# EAGLE design Open_tES (EAGLE 6.5.0)
AUTHOR: PATRICE ANDRIEU; VERSION: 1.00
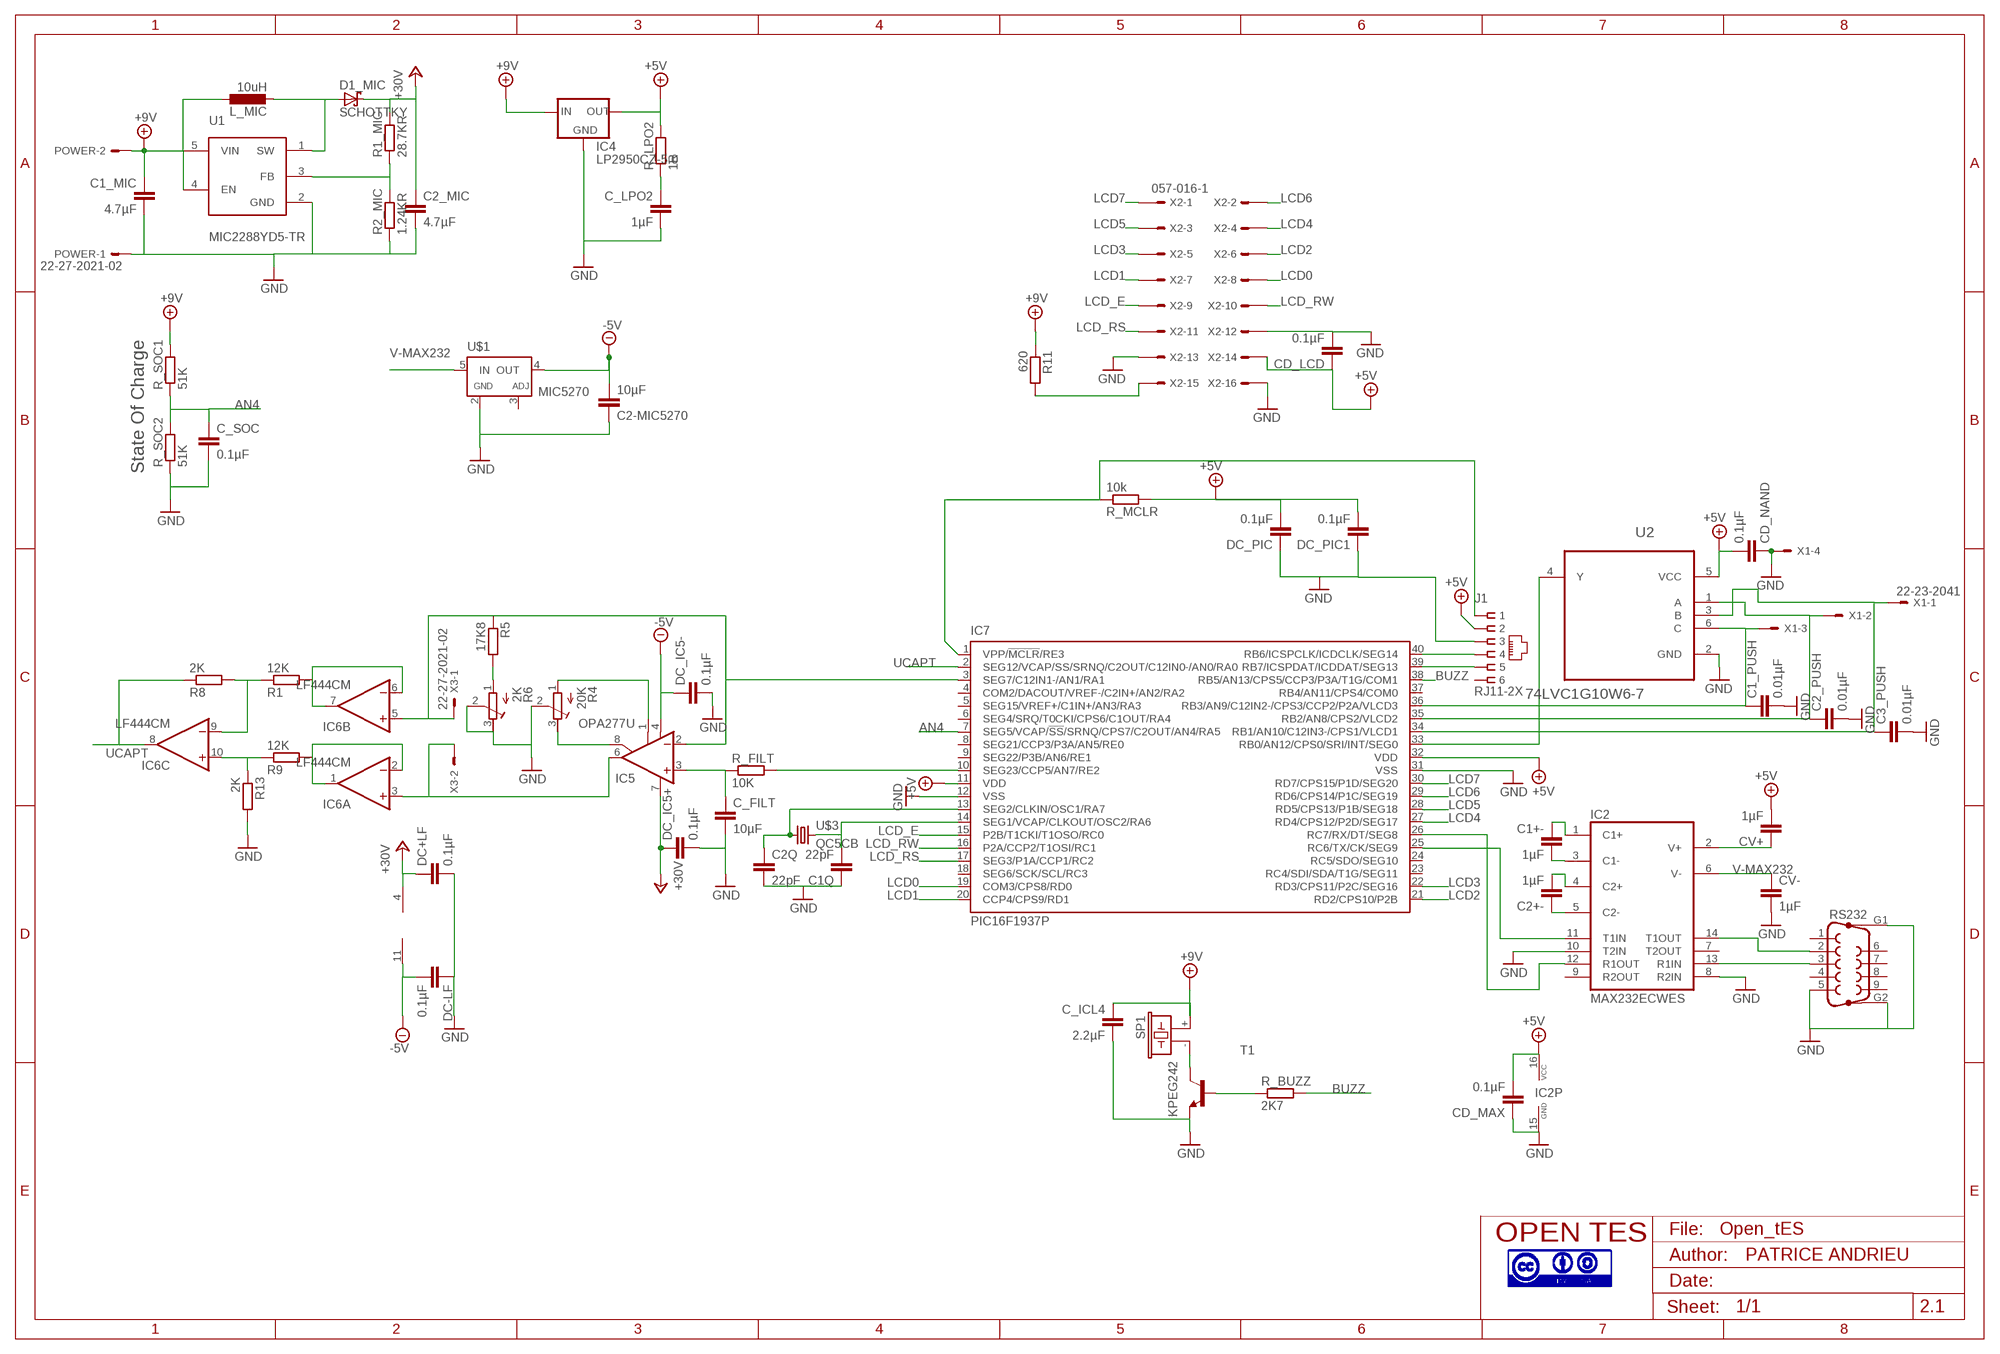
[diagram p0: schematic, sheet 1]

## Parts
C1+-  1µF  C-EUC0805  [C0805]
C1_MIC  4.7µF  C-EUC0805  [C0805]
C1_PUSH  0.01µF  C-EUC0805  [C0805]
C1Q  22pF  C-EUC0805  [C0805]
C2+-  1µF  C-EUC0805  [C0805]
C2-MIC5270  10µF  C-EUC0805  [C0805]
C2_MIC  4.7µF  C-EUC0805  [C0805]
C2_PUSH  0.01µF  C-EUC0805  [C0805]
C2Q  22pF  C-EUC0805  [C0805]
C3_PUSH  0.01µF  C-EUC0805  [C0805]
C_FILT  10µF  C-EUC0805  [C0805]
C_ICL4  2.2µF  C-EUC0805K  [C0805K]
C_LPO2  1µF  C-EUC0805  [C0805]
C_SOC  0.1µF  C-EUC0805  [C0805]
CD_LCD  0.1µF  C-EUC0805  [C0805]
CD_MAX  0.1µF  C-EUC0805  [C0805]
CD_NAND  0.1µF  C-EUC0805  [C0805]
CV+  1µF  C-EUC0805  [C0805]
CV-  1µF  C-EUC0805  [C0805]
D1_MIC  SCHOTTKY  [SOD80]
DC+LF  0.1µF  C-EUC0805  [C0805]
DC-LF  0.1µF  C-EUC0805  [C0805]
DC_IC5+  0.1µF  C-EUC0805  [C0805]
DC_IC5-  0.1µF  C-EUC0805  [C0805]
DC_PIC  0.1µF  C-EUC0805  [C0805]
DC_PIC1  0.1µF  C-EUC0805  [C0805]
IC2  MAX232ECWES  [SO16]
IC4  LP2950CZ-5.0  [TO92]
IC5  OPA277U  [SO08]
IC6  LF444CM  [SO14]
IC7  PIC16F1937P  [DIL40]
J1  RJ11-2X  [RJ11-NO_SHIELD]
L_MIC  10uH  L-EUL2012C  [L2012C]
POWER  22-27-2021-02  [6410-02]
R1  12K  R-EU_R0805  [R0805]
R1_MIC  28.7KR  R-EU_R0805  [R0805]
R2_MIC  1.24KR  R-EU_R0805  [R0805]
R4  20K  R-TRIMM3214W  [RTRIM3214W]
R5  17K8  R-EU_M0805  [M0805]
R6  2K  R-TRIMM3214W  [RTRIM3214W]
R8  2K  R-EU_R0805  [R0805]
R9  12K  R-EU_R0805  [R0805]
R11  620  R-EU_0204/7  [0204/7]
R13  2K  R-EU_R0805  [R0805]
R_BUZZ  2K7  R-EU_R0805  [R0805]
R_FILT  10K  R-EU_R0805  [R0805]
R_LPO2  1R  R-EU_R0805  [R0805]
R_MCLR  10k  R-EU_0204/7  [0204/7]
R_SOC1  51K  R-EU_R0805  [R0805]
R_SOC2  51K  R-EU_R0805  [R0805]
RS232  F09HP  [F09HP]
SP1  KPEG242  [KPEG242]
T1  BFR92-NPN-SOT23-BEC  [SOT23-BEC]
U1  MIC2288YD5-TR  [SOT23-5L]
U2  74LVC1G10W6-7  [SOT95P280X135-6N]
U$1  MIC5270  [SOT23-5L]
U$3  QC5CB  [QC5CB]
U$4  FRAME  [OPEN_TE_VERSION]
X1  22-23-2041  [22-23-2041]
X2  057-016-1  [057-016-1]
X3  22-27-2021-02  [6410-02]

## Nets
+5V/1: CD_LCD.1 CD_MAX.2 CD_NAND.2 CV+.2 DC_PIC1.2 DC_PIC.2 IC2.16(VCC) IC4.1(OUT) IC7.11(VDD) IC7.32(VDD) J1.2 R_LPO2.2 R_MCLR.2 U2.5(VCC) X2.14 ; supply symbol labelled +5V
+9V: C1_MIC.1 C_ICL4.1 IC4.3(IN) L_MIC.1 POWER.2 R11.1 R_SOC1.2 SP1.+ U1.4(EN) U1.5(VIN)
+30V: C2_MIC.1 D1_MIC.C DC+LF.1 DC_IC5+.1 IC5.7(V+) IC6.4(P:V+) R1_MIC.2
-5V: C2-MIC5270.2 DC-LF.2 DC_IC5-.1 IC5.4(V-) IC6.11(P:V-) U$1.4(OUT)
AN4: C_SOC.1 IC7.7(SEG5/VCAP/!SS!/SRNQ/CPS7/C2OUT/AN4/RA5) R_SOC1.1 R_SOC2.2
BUZZ: IC7.38(RB5/AN13/CPS5/CCP3/P3A/T1G/COM1) R_BUZZ.2
GND: C1_MIC.2 C1_PUSH.2 C1Q.1 C2-MIC5270.1 C2_MIC.2 C2_PUSH.2 C2Q.2 C3_PUSH.2 C_FILT.2 C_ICL4.2 C_LPO2.2 C_SOC.2 CD_LCD.2 CD_MAX.1 CD_NAND.1 CV-.2 DC+LF.2 DC-LF.1 DC_IC5+.2 DC_IC5-.2 DC_PIC1.1 DC_PIC.1 IC2.8(R2IN) IC2.10(T2IN) IC2.15(GND) IC4.2(GND) IC7.12(VSS) IC7.31(VSS) J1.3 POWER.1 R2_MIC.1 R4.2(S) R6.2(S) R6.3(E) R13.2 R_SOC2.1 RS232.5 RS232.G1 RS232.G2 T1.E U1.2(GND) U2.2(GND) U$1.2(GND) X1.4 X2.12 X2.13 X2.16
ICAPT: IC5.2(-IN) IC6.5(B:+IN) IC7.3(SEG7/C12IN1-/AN1/RA1) R5.1 X3.1
LCD0: IC7.19(COM3/CPS8/RD0) X2.8
LCD1: IC7.20(CCP4/CPS9/RD1) X2.7
LCD2: IC7.21(RD2/CPS10/P2B) X2.6
LCD3: IC7.22(RD3/CPS11/P2C/SEG16) X2.5
LCD4: IC7.27(RD4/CPS12/P2D/SEG17) X2.4
LCD5: IC7.28(RD5/CPS13/P1B/SEG18) X2.3
LCD6: IC7.29(RD6/CPS14/P1C/SEG19) X2.2
LCD7: IC7.30(RD7/CPS15/P1D/SEG20) X2.1
LCD_E: IC7.15(P2B/T1CKI/T1OSO/RC0) X2.9
LCD_RS: IC7.17(SEG3/P1A/CCP1/RC2) X2.11
LCD_RW: IC7.16(P2A/CCP2/T1OSI/RC1) X2.10
MCLR: IC7.1(VPP/!MCLR!/RE3) J1.1 R_MCLR.1
N$1: SP1.- T1.C
N$2: IC6.6(B:-IN) IC6.7(B:OUT) R1.2
N$3: C1+-.1 IC2.1(C1+)
N$4: R5.2 R6.1(A)
N$5: C2+-.2 IC2.4(C2+)
N$6: C1Q.2 IC7.14(SEG1/VCAP/CLKOUT/OSC2/RA6) U$3.2
N$7: IC2.14(T1OUT) RS232.2
N$8: IC2.13(R1IN) RS232.3
N$9: C3_PUSH.1 IC7.34(RB1/AN10/C12IN3-/CPS1/VLCD1) U2.3(B) X1.1
N$10: R1_MIC.1 R2_MIC.2 U1.3(FB)
N$11: IC2.11(T1IN) IC7.25(RC6/TX/CK/SEG9)
N$12: R_BUZZ.1 T1.B
N$13: IC6.10(C:+IN) R9.1 R13.1
N$14: IC6.9(C:-IN) R1.1 R8.2
N$15: IC2.12(R1OUT) IC7.26(RC7/RX/DT/SEG8)
N$16: IC5.8(CMP2) R4.3(E)
N$17: IC6.1(A:OUT) IC6.2(A:-IN) R9.2
N$18: C1_PUSH.1 IC7.36(RB3/AN9/C12IN2-/CPS3/CCP2/P2A/VLCD3) U2.6(C) X1.3
N$19: C_FILT.1 IC5.3(+IN) R_FILT.1
N$20: C2Q.1 IC7.13(SEG2/CLKIN/OSC1/RA7) U$3.1
N$21: C_LPO2.1 R_LPO2.1
N$22: C1+-.2 IC2.3(C1-)
N$23: C2_PUSH.1 IC7.35(RB2/AN8/CPS2/VLCD2) U2.1(A) X1.2
N$25: IC7.33(RB0/AN12/CPS0/SRI/INT/SEG0) U2.4(Y)
N$28: IC5.1(CMP1) R4.1(A)
N$29: IC5.6(OUT) IC6.3(A:+IN) X3.2
N$30: C2+-.1 IC2.5(C2-)
N$31: CV+.1 IC2.2(V+)
N$32: R11.2 X2.15
N$35: D1_MIC.A L_MIC.2 U1.1(SW)
PGC: IC7.39(RB7/ICSPDAT/ICDDAT/SEG13) J1.5
PGD: IC7.40(RB6/ICSPCLK/ICDCLK/SEG14) J1.4
PWM: IC7.10(SEG23/CCP5/AN7/RE2) R_FILT.2
UCAPT: IC6.8(C:OUT) IC7.2(SEG12/VCAP/SS/SRNQ/C2OUT/C12IN0-/AN0/RA0) R8.1
V-MAX232: CV-.1 IC2.6(V-) U$1.5(IN)
Unconnected: IC2.7(T2OUT) IC2.9(R2OUT) IC6.12(D:+IN) IC6.13(D:-IN) IC6.14(D:OUT) IC7.4(COM2/DACOUT/VREF-/C2IN+/AN2/RA2) IC7.5(SEG15/VREF+/C1IN+/AN3/RA3) IC7.6(SEG4/SRQ/T0CKI/CPS6/C1OUT/RA4) IC7.8(SEG21/CCP3/P3A/AN5/RE0) IC7.9(SEG22/P3B/AN6/RE1) IC7.18(SEG6/SCK/SCL/RC3) IC7.23(RC4/SDI/SDA/T1G/SEG11) IC7.24(RC5/SDO/SEG10) IC7.37(RB4/AN11/CPS4/COM0) J1.6 RS232.1 RS232.4 RS232.6 RS232.7 RS232.8 RS232.9 U$1.3(ADJ)

## Notes on the sheet
- State Of Charge

## Library data of the parts
C1+- C2+- C_LPO2 CV+ CV- = rcl:C-EU: CAPACITOR, European symbol; OC_FARNELL: 2496946
C1_MIC = rcl:C-EU: CAPACITOR, European symbol; OC_FARNELL: 2458302
C1_PUSH C2_PUSH C3_PUSH = rcl:C-EU: CAPACITOR, European symbol; OC_FARNELL: 1414662
C1Q C2Q = rcl:C-EU: CAPACITOR, European symbol; OC_FARNELL: 1856180
C2-MIC5270 C_FILT = rcl:C-EU: CAPACITOR, European symbol; OC_FARNELL: 2346934
C2_MIC = rcl:C-EU: CAPACITOR, European symbol; OC_FARNELL: 2426962
C_ICL4 = rcl:C-EU: CAPACITOR, European symbol; OC_FARNELL: 9227822
C_SOC CD_LCD CD_MAX CD_NAND DC-LF DC_IC5+ DC_IC5- DC_PIC DC_PIC1 = rcl:C-EU: CAPACITOR, European symbol; OC_FARNELL: 1414664
D1_MIC = Open_tES:SCHOTTKY: Schottky diode; OC_FARNELL: 1469389
DC+LF = rcl:C-EU: CAPACITOR, European symbol; OC_FARNELL: 1653290
IC2 = maxim-6b:MAX232ECWE: RS232 TRANSEIVER; OC_FARNELL: 2511968
IC4 = v-reg:LP2950?*: Source: http://cache.national.com/ds/LP/LP2950.pdf; OC_FARNELL: 9489479
IC5 = linear:OPA277: High Precision OPERATIONAL AMPLIFIERS REPLACES OP-07, OP-77, OP-177 Source: opa277.pdf; OC_FARNELL: 1097478
IC6 = Open_tES:LF444CM; OC_FARNELL: 1564711
IC7 = microchip:PIC16F193*?: Flash-Based, 8-Bit CMOS Microcontrollers wtih LCD Driver and nanoWatt XLP Technology Auto generated by make-symbol-device-package-bsdl.ulp Rev. 33 Source: http://ww1.microchip.com/downloads/en/DeviceDoc/41364D.pdf; MPN: PIC16F1937-I/P; OC_FARNELL: 1755825; OC_NEWARK: 45P4774
J1 = con-tycoelectronics:RJ11: CORCOM Modular RJ Jacks No Shield Source: www.tycoelectronics.com .. ENG_DS_1654001_1099_RJ_L_0507.pdf; OC_FARNELL: 3363132; OC_NEWARK: unknown
L_MIC = rcl:L-EU: INDUCTOR, European symbol; OC_FARNELL: 1463501
POWER X3 = con-molex:22-?-02: CONNECTOR wire to board 2.54 mm (.1 inch) pitch header; OC_FARNELL: 9731148+1654528+1462641; OC_NEWARK: unknown
R1 R9 = rcl:R-EU_: RESISTOR, European symbol; OC_FARNELL: 1653290
R1_MIC = rcl:R-EU_: RESISTOR, European symbol; OC_FARNELL: 1167459
R2_MIC = rcl:R-EU_: RESISTOR, European symbol; OC_FARNELL: 2303560
R4 = rcl:R-TRIMM: Trimm resistor; OC_FARNELL: 988285
R5 = rcl:R-EU_: RESISTOR, European symbol; OC_FARNELL: 1575931
R6 = rcl:R-TRIMM: Trimm resistor; OC_FARNELL: 988250
R8 R13 = rcl:R-EU_: RESISTOR, European symbol; OC_FARNELL: 1653296
R11 = rcl:R-EU_: RESISTOR, European symbol; OC_FARNELL: 2329960
R_BUZZ = rcl:R-EU_: RESISTOR, European symbol; OC_FARNELL: 9339361
R_FILT = rcl:R-EU_: RESISTOR, European symbol; OC_FARNELL: 9332383
R_LPO2 = rcl:R-EU_: RESISTOR, European symbol; OC_FARNELL: 2057662
R_MCLR = rcl:R-EU_: RESISTOR, European symbol; OC_FARNELL: 9339060
R_SOC1 R_SOC2 = rcl:R-EU_: RESISTOR, European symbol; OC_FARNELL: 2447680
RS232 = con-subd:F09HP: SUB-D; OC_FARNELL: 1084701; OC_NEWARK: unknown
SP1 = Open_tES:KPEG242; OC_FARNELL: 1502726
T1 = transistor-neu-to92:*-NPN-: NPN Transistror; OC_FARNELL: 1056520; OV_FARNELL: 1056520RL
U1 = Open_tES:MIC2288YD5-TR: Regulator DC/DC boost in 2.5-10V out 3.6-34V; OC_FARNELL: 2509929
U2 = Open_tES:74LVC1G10W6-7: SINGLE 3 INPUT POSITIVE NAND GATE; MPN: 74LVC1G10W6-7; OC_FARNELL: 1893823; OC_NEWARK: 47T3912; PACKAGE: SOT-6; SUPPLIER: DIODES INC.
U$1 = Open_tES:MIC5270: Negative Low-dropout Regulator; OC_FARNELL: 2510309
U$3 = Open_tES:QC5CB; OC_FARNELL: 2508614
U$4 = Open_tES:FRAME; VERSION: 2.1
X1 = con-molex:22-23-2041: .100" (2.54mm) Center Header - 4 Pin; MF: MOLEX; MPN: 22-23-2041; OC_FARNELL: 1462920+1462809+1462641; OC_NEWARK: 38C0355
X2 = con-panduit:057-016-: CONNECTOR 10-pin series 057 contact pc board low profile headers; OC_FARNELL: 1554029; OC_NEWARK: unknown

## Board
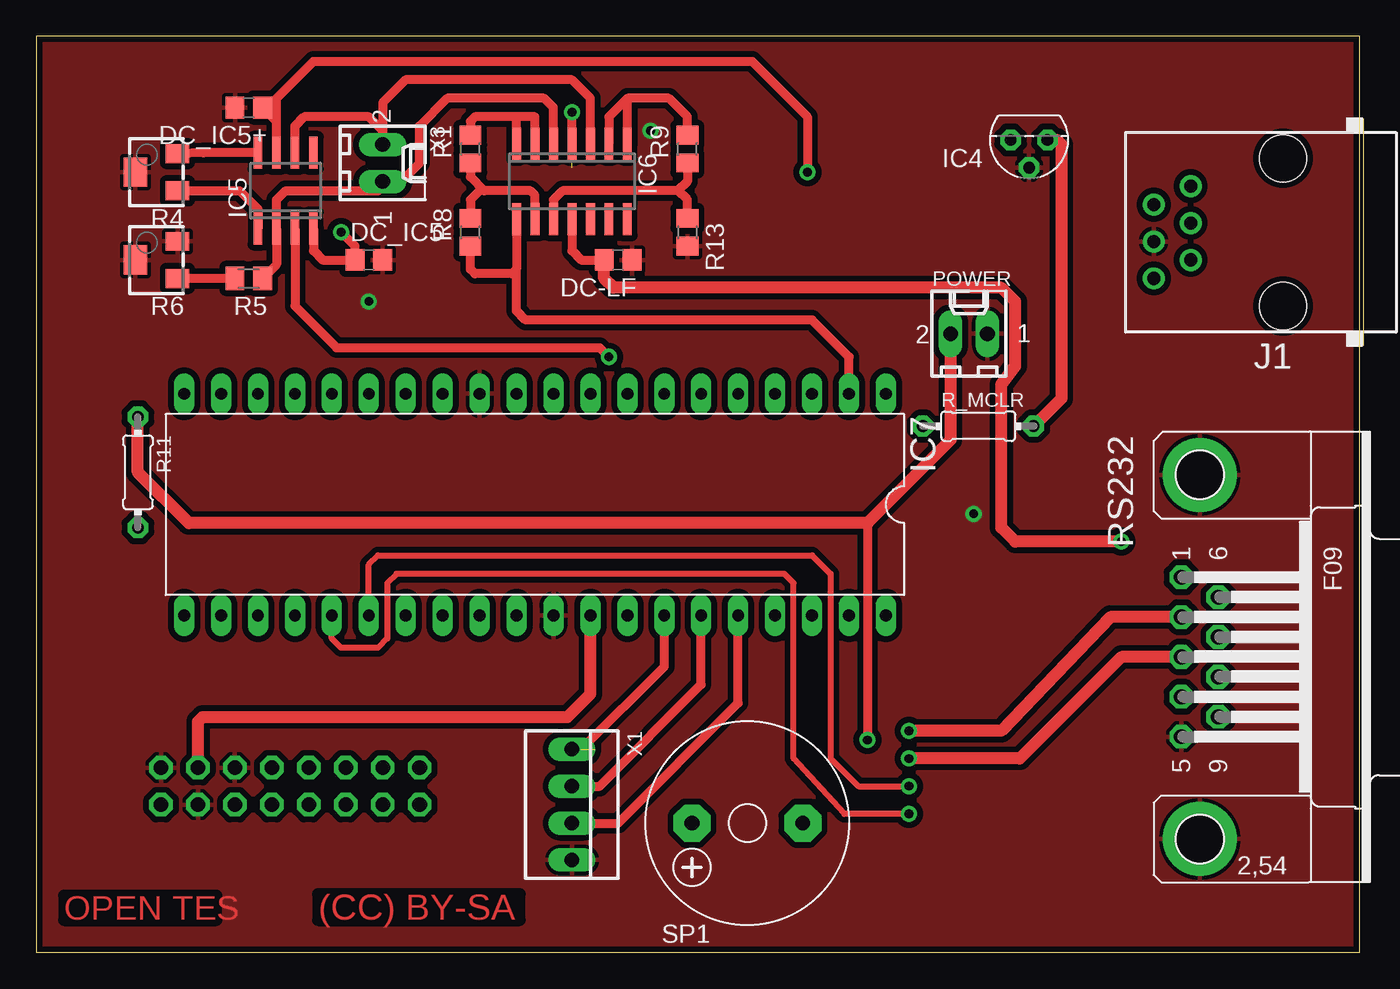
[diagram p1: board, top side]
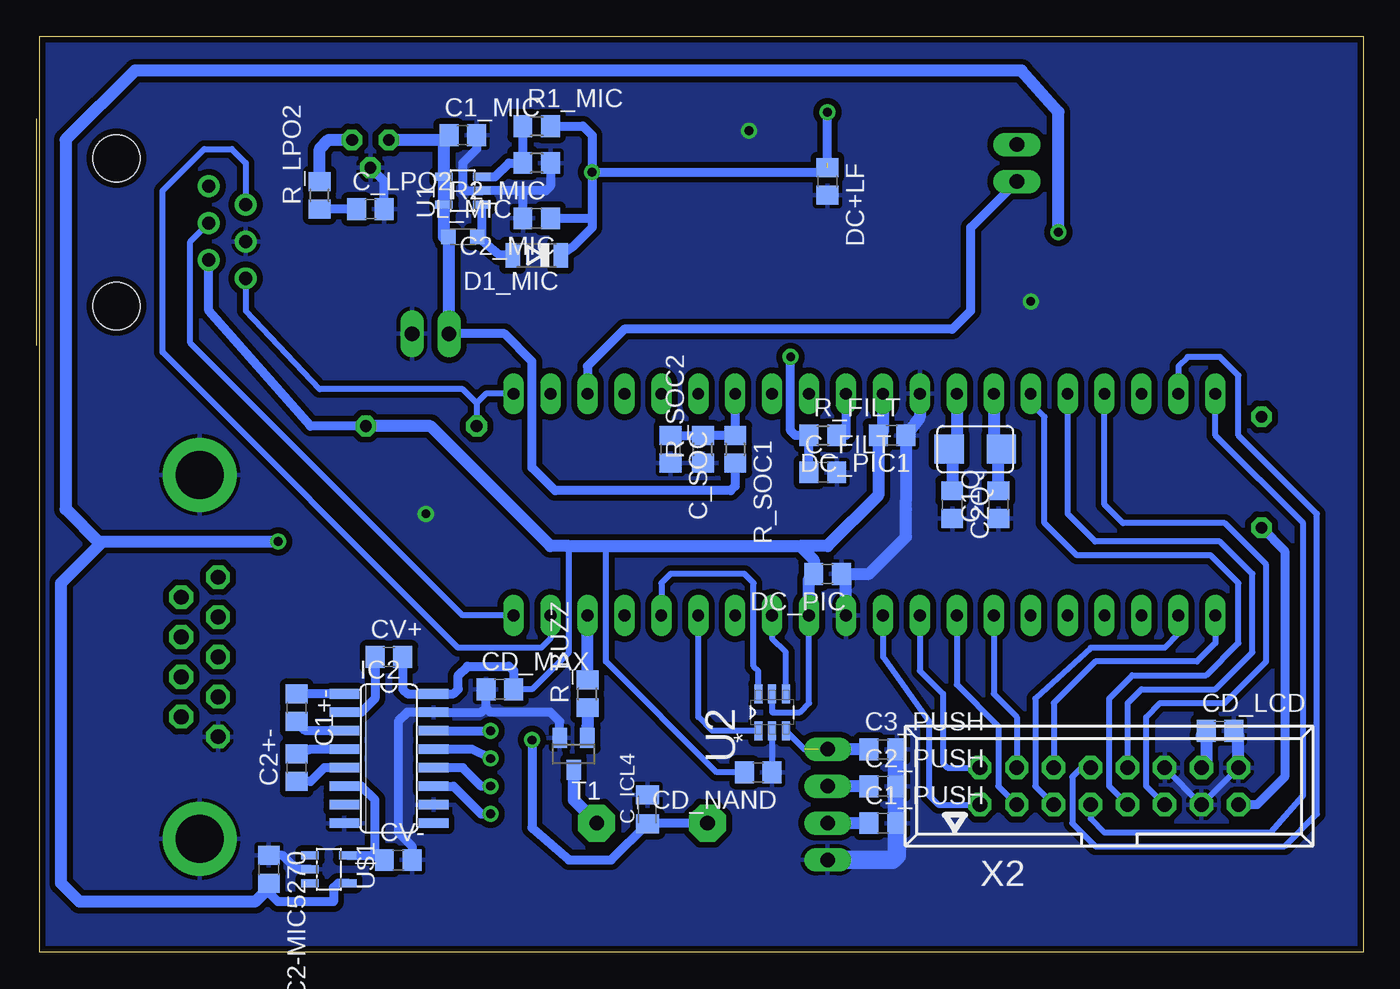
[diagram p2: board, bottom side, seen from below]

Size 91 x 63 mm. Coordinates in mm from the lower left corner, seen from the top.
Outline: 0,0 91,0 91,63 0,63 0,0
Copper layers (1*16): Top 0.035mm / dielectric 1.5mm / Bottom 0.035mm
Design rules "SparkFun": minimum track width 8mil, minimum drill 20mil, track to track 8mil, track to pad 8mil, pad to pad 8mil, via to via 8mil, smd to smd 8mil, copper to edge 10mil, drill to drill 8mil, minimum pad ring 12mil, minimum via ring 10mil, stop-mask expansion 4mil, vias tented up to drill 25mil, thermal gap 10mil

### Footprints (pad centres in the part's own frame; a part is rotated, then mirrored left to right if it is on the bottom)
C0805 = smd 1.3 x 1.5: 1 -0.95,0; 2 0.95,0
C0805K = smd 1.3 x 1.6: 1 -1,0; 2 1,0
SOD80 = smd 1 x 1.7: A 1.65,0; C -1.65,0
SO16 = smd 0.66 x 2.032: 1 -4.445,-3.073; 2 -3.175,-3.073; 3 -1.905,-3.073; 4 -0.635,-3.073; 5 0.635,-3.073; 6 1.905,-3.073; 7 3.175,-3.073; 8 4.445,-3.073; 9 4.445,3.073; 10 3.175,3.073; 11 1.905,3.073; 12 0.635,3.073; 13 -0.635,3.073; 14 -1.905,3.073; 15 -3.175,3.073; 16 -4.445,3.073
TO92 = drill 0.813 octagon: 1 -1.27,0; 2 0,1.905; 3 1.27,0
SO08 = smd 0.6 x 2.2: 1 -1.905,-2.6; 2 -0.635,-2.6; 3 0.635,-2.6; 4 1.905,-2.6; 5 1.905,2.6; 6 0.635,2.6; 7 -0.635,2.6; 8 -1.905,2.6
SO14 = smd 0.6 x 2.2: 1 -3.81,-2.6; 2 -2.54,-2.6; 3 -1.27,-2.6; 4 0,-2.6; 5 1.27,-2.6; 6 2.54,-2.6; 7 3.81,-2.6; 8 3.81,2.6; 9 2.54,2.6; 10 1.27,2.6; 11 0,2.6; 12 -1.27,2.6; 13 -2.54,2.6; 14 -3.81,2.6
DIL40 = drill 0.813 long: 1 -24.13,-7.62; 2 -21.59,-7.62; 3 -19.05,-7.62; 4 -16.51,-7.62; 5 -13.97,-7.62; 6 -11.43,-7.62; 7 -8.89,-7.62; 8 -6.35,-7.62; 9 -3.81,-7.62; 10 -1.27,-7.62; 11 1.27,-7.62; 12 3.81,-7.62; 13 6.35,-7.62; 14 8.89,-7.62; 15 11.43,-7.62; 16 13.97,-7.62; 17 16.51,-7.62; 18 19.05,-7.62; 19 21.59,-7.62; 20 24.13,-7.62; 21 24.13,7.62; 22 21.59,7.62; 23 19.05,7.62; 24 16.51,7.62; 25 13.97,7.62; 26 11.43,7.62; 27 8.89,7.62; 28 6.35,7.62; 29 3.81,7.62; 30 1.27,7.62; 31 -1.27,7.62; 32 -3.81,7.62; 33 -6.35,7.62; 34 -8.89,7.62; 35 -11.43,7.62; 36 -13.97,7.62; 37 -16.51,7.62; 38 -19.05,7.62; 39 -21.59,7.62; 40 -24.13,7.62
RJ11-NO_SHIELD = drill 0.9 pad 1.4: 1 -3.175,8.89; 2 -1.905,6.35; 3 -0.635,8.89; 4 0.635,6.35; 5 1.905,8.89; 6 3.175,6.35 | hole 3.251: -5.08,0; 5.08,0
L2012C = smd 1 x 1: 1 -1,0; 2 1,0
6410-02 = drill 1.016 long: 1 1.27,0; 2 -1.27,0
R0805 = smd 1.3 x 1.5: 1 -0.95,0; 2 0.95,0
RTRIM3214W = smd 1.3 x 1.6: 1 -1.275,-1.45; 3 1.275,-1.45 | smd 2 x 1.6: 2 0,1.45
M0805 = smd 1.3 x 1.6: 1 -0.95,0; 2 0.95,0
0204/7 = drill 0.813 octagon: 1 -3.81,0; 2 3.81,0
F09HP = drill 1.016 octagon: 1 -5.486,-1.27; 2 -2.743,-1.27; 3 0,-1.27; 4 2.743,-1.27; 5 5.486,-1.27; 6 -4.115,1.27; 7 -1.372,1.27; 8 1.372,1.27; 9 4.115,1.27 | drill 3.302 pad 5.08: G1 -12.522,0; G2 12.522,0
KPEG242 = drill 1.016 pad 2.54 octagon: + 3.81,0; - -3.81,0
SOT23-BEC = smd 1 x 1.4: B -0.95,-1.1; C 0,1.1; E 0.95,-1.1
SOT23-5L = smd 0.55 x 1.2: 1 -0.95,-1.3; 2 0,-1.3; 3 0.95,-1.3; 4 0.95,1.3; 5 -0.95,1.3
SOT95P280X135-6N = smd 1.321 x 0.559: 1 -1.27,0.94; 2 -1.27,0; 3 -1.27,-0.94; 4 1.27,-0.94; 5 1.27,0; 6 1.27,0.94
QC5CB = smd 2 x 2: 1 -1.8,0; 2 1.8,0
22-23-2041 = drill 1 long: 1 -3.81,0; 2 -1.27,0; 3 1.27,0; 4 3.81,0
057-016-1 = drill 1 octagon: 1 -8.89,-1.27; 2 -8.89,1.27; 3 -6.35,-1.27; 4 -6.35,1.27; 5 -3.81,-1.27; 6 -3.81,1.27; 7 -1.27,-1.27; 8 -1.27,1.27; 9 1.27,-1.27; 10 1.27,1.27; 11 3.81,-1.27; 12 3.81,1.27; 13 6.35,-1.27; 14 6.35,1.27; 15 8.89,-1.27; 16 8.89,1.27

### Placement (x,y rotation side)
C1+-  73.34,16.83 270 bottom
C1_MIC  61.91,56.2 0 bottom
C1_PUSH  33.02,8.89 0 bottom
C1Q  25.08,30.8 90 bottom
C2+-  73.34,12.7 90 bottom
C2-MIC5270  75.25,5.71 270 bottom
C2_MIC  56.83,50.48 180 bottom
C2_PUSH  33.02,11.43 0 bottom
C2Q  28.26,30.8 270 bottom
C3_PUSH  33.02,13.97 0 bottom
C_FILT  37.15,33.02 0 bottom
C_ICL4  49.21,9.84 90 bottom
C_LPO2  68.26,51.12 0 bottom
C_SOC  47.62,34.61 270 bottom
CD_LCD  9.84,15.24 0 bottom
CD_MAX  59.37,18.1 0 bottom
CD_NAND  41.59,12.38 180 bottom
CV+  66.99,20.32 0 bottom
CV-  66.36,6.35 0 bottom
D1_MIC  56.83,47.94 180 bottom
DC+LF  36.83,53.02 270 bottom
DC-LF  40.01,47.62 180 top
DC_IC5+  14.61,58.1 180 top
DC_IC5-  22.86,47.62 0 top
DC_PIC  36.83,26.04 180 bottom
DC_PIC1  32.38,35.56 180 bottom
IC2  66.99,13.34 270 bottom
IC4  68.26,55.88 180 top
IC5  17.14,52.39 0 top
IC6  36.83,53.02 180 top
IC7  34.29,30.8 180 top
J1  85.72,49.53 90 top
L_MIC  61.91,49.21 0 bottom
POWER  64.14,42.55 0 top
R1  29.84,55.24 90 top
R1_MIC  56.83,56.83 0 bottom
R2_MIC  56.83,54.29 180 bottom
R4  8.26,53.66 90 top
R5  14.61,46.35 180 top
R6  8.26,47.62 90 top
R8  29.84,49.53 90 top
R9  44.77,55.24 90 top
R11  6.99,33.02 270 top
R13  44.77,49.53 270 top
R_BUZZ  53.34,17.78 90 bottom
R_FILT  37.15,35.56 0 bottom
R_LPO2  71.75,52.07 90 bottom
R_MCLR  64.77,36.2 0 top
R_SOC1  43.18,34.61 270 bottom
R_SOC2  45.4,34.61 90 bottom
RS232  80.01,20.32 270 top
SP1  48.9,8.89 180 top
T1  54.29,13.65 180 bottom
U1  61.91,52.39 90 bottom
U2  40.64,16.51 90 bottom
U$1  71.12,5.71 270 bottom
U$3  26.67,34.61 0 bottom
U$4  1.91,2.22 0 top
X1  36.83,10.16 270 top
X2  17.46,11.43 0 bottom
X3  23.81,54.29 270 top

### Tracks (layer width: path | path; a pad name or v marks a point on that pad's centre or on a via)
+5V/1
  Top 0.813: X2.14 11.11,15.88 11.43,16.19 36.51,16.19 38.1,17.78 IC7.32 | IC4.1 70.17,55.88 70.48,55.56 70.48,38.1 R_MCLR.2
  Bottom 0.406: 54.61,27.94 54.61,20.64 57.15,18.1 CD_MAX.2 | U2.5 40.64,16.51 38.73,16.51 38.1,17.14 IC7.32 | 52.07,27.94 52.07,20 44.45,12.38 CD_NAND.2
  Bottom 0.61: CV+.2 66.04,18.1 65.72,17.78 IC2.16 62.55,17.78 62.23,18.1 62.23,19.05 61.59,19.68 58.74,19.68 58.42,19.37 58.42,18.73 CD_MAX.2 | R_MCLR.2 72.39,36.2 79.38,44.13 J1.2
  Bottom 0.813: 38.73,27.94 52.07,27.94 54.61,27.94 55.88,27.94 64.14,36.2 R_MCLR.2 | 38.73,27.94 37.78,26.98 DC_PIC.2 38.1,25.71 IC7.32 | 11.11,14.92 CD_LCD.1 10.79,13.02 X2.14 | IC7.11 33.02,35.88 DC_PIC1.2 33.34,31.43 36.83,27.94 38.73,27.94 | R_LPO2.2 71.75,55.24 71.12,55.88 IC4.1
+9V  (via drill 0.6)
  Top 0.61: 57.15,29.53 v57.15,14.61
  Top 0.813: POWER.2 62.87,35.24 57.15,29.53 10.48,29.53 6.99,33.02 R11.1
  Bottom 0.61: v57.15,14.61 57.15,8.57 54.61,6.35 51.7,6.35 C_ICL4.1 | SP1.+ 49.16,8.89 | C1_MIC.1 63.21,55.85 | 63.21,49.21 L_MIC.1 | R_SOC1.2 43.18,32.07 43.5,31.75 55.56,31.75 57.15,33.34 57.15,40.64 59.05,42.55 POWER.2
  Bottom 0.813: 49.16,8.89 C_ICL4.1 | POWER.2 62.87,48.94 L_MIC.1 | 63.21,49.21 U1.5 U1.4 63.21,55.85 66.96,55.85 IC4.3
+30V  (via drill 0.6)  (1 unrouted)
  Top 0.61: DC_IC5+.1 16.51,57.15 IC5.7 16.51,58.74 19.05,61.28 49.21,61.28 53.02,57.47 v53.02,53.66 | IC6.4 v36.83,57.78
  Bottom 0.61: R1_MIC.2 53.66,56.83 53.02,56.2 v53.02,53.66 | v53.02,53.66 53.02,50.48 | 53.02,50.48 53.02,49.85 54.29,48.58 D1_MIC.C | C2_MIC.1 53.02,50.48 | 36.83,54.29 v36.83,57.78 | v53.02,53.66 37.15,53.66 DC+LF.1
-5V  (via drill 0.6)
  Top 0.61: IC6.11 36.83,48.26 37.47,47.62 DC-LF.2 | IC5.4 19.05,48.26 19.68,47.62 DC_IC5-.1 21.91,48.58 v20.95,49.53
  Top 0.813: DC-LF.2 39.05,47.3 39.05,46.35 39.69,45.72 66.36,45.72 67.31,44.77 67.31,40.32 66.36,39.05 66.36,29.21 67.31,28.26 v74.61,28.26
  Bottom 0.61: U$1.4 70.48,4.76 70.8,4.45 70.8,3.49 74.61,3.49 75.41,4.29
  Bottom 0.813: C2-MIC5270.2 75.25,4.45 75.41,4.29 76.2,3.49 88.27,3.49 89.53,4.76 89.53,25.4 86.84,28.1 | v20.95,49.53 20.95,57.78 23.5,60.64 84.45,60.64 89.22,55.88 89.22,30.48 86.84,28.1 | 86.84,28.1 86.68,28.26 v74.61,28.26
AN4
  Bottom 0.61: C_SOC.1 R_SOC2.2 R_SOC1.1 IC7.7
BUZZ
  Bottom 0.813: R_BUZZ.2 IC7.38
GND  (via drill 0.6)
  Bottom 0.406: X2.12 X2.13 X2.16 | U2.2 CD_NAND.1
  Bottom 0.61: CV-.2 65.41,7.3 66.36,8.26 66.36,15.88 65.72,16.51 IC2.15 60.64,16.51 60.33,16.83 | 60.33,16.83 CD_MAX.1 | T1.E 55.24,15.87 55.88,16.51 60.01,16.51 60.33,16.83 | R2_MIC.1 55.88,52.7 56.2,52.39 58.1,52.39 | 58.1,52.39 U1.2 61.91,52.39 61.91,54.29 60.96,55.24 C1_MIC.2 | C2_MIC.2 57.78,52.07 58.1,52.39 | C_LPO2.2 67.31,53.02 IC4.2 | U$1.2 73.34,5.71 74.3,6.67 C2-MIC5270.1
  Bottom 0.813: X2.16 8.57,14.92 CD_LCD.2 | IC7.12 30.48,36.83 DC_PIC1.1 31.43,31.11 31.43,30.48 31.43,28.57 33.97,26.04 DC_PIC.1 35.56,25.71 IC7.31
  Bottom 1.27: C3_PUSH.2 C2_PUSH.2 C1_PUSH.2 32.07,8.57 32.07,6.67 32.38,6.35 X1.4
  other vias: 22.86,44.77 64.45,30.16 42.23,56.52
  pour Bottom (isolate 0.406): -0.32,63.5 -0.32,-0.32 91.44,-0.32 91.44,63.5
  pour Top (isolate 0.406): -0.32,63.5 -0.32,-0.32 91.44,-0.32 91.44,63.5
ICAPT
  Top 0.61: R5.1 16.51,47.31 IC5.2 16.51,51.75 17.14,52.39 23.5,52.39 23.81,52.7 X3.1 25.08,53.02 26.35,54.29 26.35,56.83 28.26,58.74 34.92,58.74 35.56,58.1 IC6.5
  Bottom 0.61: IC7.3 53.34,40.32 50.8,42.86 28.26,42.86 26.99,44.13 26.99,49.85 X3.1
LCD0
  Bottom 0.406: X2.8 19.37,12.7 20,12.06 20,8.89 18.41,7.3 5.4,7.3 3.17,9.53 3.17,30.16 8.57,35.56 8.57,39.69 9.84,40.96 12.06,40.96 12.7,40.32 IC7.19
LCD1
  Bottom 0.406: X2.7 18.73,9.21 17.78,8.26 6.35,8.26 4.13,10.79 4.13,29.53 10.16,35.56 IC7.20
LCD2
  Bottom 0.406: IC7.21 10.16,21.27 11.43,20 18.41,20 21.27,17.14 X2.6
LCD3
  Bottom 0.406: IC7.22 12.7,21.91 13.65,20.95 18.73,20.95 22.54,17.46 22.54,11.43 X2.5
LCD4
  Bottom 0.406: IC7.27 25.4,17.78 23.81,16.19 X2.4
LCD5
  Bottom 0.406: IC7.28 27.94,18.41 25.08,15.56 25.08,11.43 X2.3
LCD6
  Bottom 0.406: IC7.29 30.48,19.37 28.89,17.78 28.89,13.02 28.57,12.7 X2.2
LCD7
  Bottom 0.406: IC7.30 33.02,20.32 29.84,15.88 29.84,10.79 29.21,10.16 X2.1
LCD_E
  Bottom 0.406: X2.9 17.46,11.43 17.46,17.46 15.88,19.05 10.79,19.05 8.57,21.27 8.57,25.4 10.48,27.3 19.68,27.3 21.91,29.53 21.91,36.83 22.86,37.78 IC7.15
LCD_RS
  Bottom 0.406: X2.11 14.92,11.43 14.92,16.19 13.97,17.14 9.53,17.14 6.67,20 6.67,26.67 9.53,29.53 16.51,29.53 17.78,30.8 IC7.17
LCD_RW
  Bottom 0.406: X2.10 16.19,17.14 15.24,18.1 10.16,18.1 7.62,20.64 7.62,26.04 9.84,28.26 18.41,28.26 20.32,30.16 IC7.16
MCLR
  Bottom 0.406: J1.1 76.83,44.13 71.75,38.73 61.91,38.73 60.96,37.78 | IC7.1 60.33,38.42 60.96,37.78 | 60.96,37.78 R_MCLR.1
N$1
  Bottom 0.813: T1.C 54.29,10.48 SP1.-
N$2
  Top 0.61: IC6.6 34.29,57.47 33.02,57.47 | IC6.7 33.02,57.47 | 33.02,57.47 30.16,57.47 29.84,57.15 R1.2
N$3
  Bottom 0.61: IC2.1 73.02,17.78 C1+-.1
N$4
  Top 0.61: R5.2 R6.1
N$5
  Bottom 0.61: IC2.4 72.39,13.97 C2+-.2
N$6
  Bottom 0.813: IC7.14 25.4,35.14 U$3.2 25.08,34.4 C1Q.2
N$7  (via drill 0.6)
  Top 0.813: RS232.2 73.86,23.06 66.36,15.24 v60.01,15.24
  Bottom 0.61: IC2.14 v60.01,15.24
N$8  (via drill 0.6)
  Top 0.813: RS232.3 74.61,20.32 67.63,13.34 v60.01,13.34
  Bottom 0.61: v60.01,13.34 61.28,13.97 IC2.13
N$9  (1 unrouted)
  Top 0.61: IC7.34 43.18,19.68 37.47,13.97 X1.1
  Bottom 0.406: 38.43,13.97 U2.3
  Bottom 0.813: C3_PUSH.1 X1.1
N$10
  Bottom 0.61: U1.3 59.69,53.34 58.74,54.29 R2_MIC.2 R1_MIC.1
N$11  (via drill 0.6)
  Top 0.406: v60.01,9.53 55.56,9.53 52.07,13.34 52.07,25.4 51.44,26.04 24.77,26.04 24.13,25.4 24.13,21.59 23.5,20.95 20.95,20.95 20.32,21.59 IC7.25
  Bottom 0.61: IC2.11 62.55,11.43 60.64,9.53 v60.01,9.53
N$12
  Bottom 0.813: R_BUZZ.1 53.34,15.56 T1.B
N$13
  Top 0.61: R13.1 44.77,51.75 44.13,52.39 | 44.13,52.39 36.2,52.39 35.56,51.75 IC6.10 | R9.1 44.77,53.02 44.13,52.39
N$14
  Top 0.61: IC6.9 34.29,52.07 33.97,52.39 30.8,52.39 | 30.8,52.39 30.48,52.39 29.84,51.75 R8.2 | R1.1 29.84,53.34 30.8,52.39
N$15  (via drill 0.6)
  Top 0.406: IC7.26 22.86,26.67 23.5,27.3 53.34,27.3 54.61,26.04 54.61,13.34 56.52,11.43 v60.01,11.43
  Bottom 0.61: v60.01,11.43 60.64,11.43 61.91,12.7 IC2.12
N$16
  Top 0.61: IC5.8 11.49,54.99 R4.3
N$17
  Top 0.61: R9.2 44.77,57.47 43.5,58.74 40.64,58.74 | 40.64,58.74 39.37,57.47 IC6.2 | IC6.1 40.64,58.74
N$18
  Top 0.61: X1.3 40.01,8.89 48.26,17.14 IC7.36
  Bottom 0.406: U2.6 41.58,19.36 41.91,19.68 41.91,25.4 42.55,26.04 47.62,26.04 48.26,25.4 IC7.36
  Bottom 0.813: C1_PUSH.1 X1.3
N$19  (via drill 0.6)
  Top 0.61: IC5.3 17.78,44.45 20.64,41.59 38.73,41.59 v39.37,40.96
  Bottom 0.61: v39.37,40.96 39.37,35.88 39.05,35.56 R_FILT.1 C_FILT.1
N$20
  Bottom 0.813: IC7.13 27.94,35.14 U$3.1 27.94,34.08 arc-90 28.26,33.76 C2Q.1
N$21
  Bottom 0.61: C_LPO2.1 R_LPO2.1
N$22
  Bottom 0.61: IC2.3 72.7,15.24 C1+-.2
N$23
  Top 0.61: X1.2 38.73,11.43 45.72,18.41 IC7.35
  Bottom 0.406: U2.1 44.77,15.24 45.72,16.19 IC7.35
  Bottom 0.813: C2_PUSH.1 X1.2
N$25
  Bottom 0.406: IC7.33 40.64,21.59 39.7,20.65 U2.4
N$28
  Top 0.61: R4.1 13.97,52.39 15.24,51.12 IC5.1
N$29
  Top 0.61: IC5.6 17.78,56.83 18.41,57.47 22.86,57.47 23.81,56.52 X3.2 23.81,58.42 25.4,60.01 36.83,60.01 38.1,58.74 IC6.3
N$30
  Bottom 0.61: IC2.5 71.44,12.7 72.39,11.75 C2+-.1
N$31
  Bottom 0.61: CV+.1 67.94,17.46 68.9,16.51 IC2.2
N$32
  Bottom 0.61: R11.2 5.4,27.62 5.4,12.06 7.3,10.16 X2.15
N$35
  Bottom 0.61: U1.1 60.61,49.21 L_MIC.2 59.37,47.94 D1_MIC.A
PGC
  Bottom 0.406: IC7.39 55.88,21.59 56.52,20.95 62.23,20.95 82.55,41.27 82.55,52.39 79.69,55.24 77.79,55.24 76.83,54.29 J1.5
PGD
  Bottom 0.406: IC7.40 61.91,23.18 80.64,41.91 80.64,48.9 J1.4
PWM
  Bottom 0.61: IC7.10 35.56,35.56 R_FILT.2
UCAPT
  Top 0.61: IC7.2 55.88,40.96 53.34,43.5 33.66,43.5 33.02,44.13 33.02,46.99 | IC6.8 33.02,46.99 | 33.02,46.99 32.7,46.67 30.16,46.67 29.84,46.99 R8.1
V-MAX232
  Bottom 0.61: IC2.6 68.9,11.43 67.94,10.47 67.94,6.67 67.63,6.35 CV-.1 67.62,6.67 U$1.5

### Text on the board
Top: (CC) BY-SA